# Altium schematic sheet gps_blk.SchDoc
size A4; Engineer: JBayalas; DocumentNumber: 6; Revision: V1.0; SheetNumber: 6; SheetTotal: 11
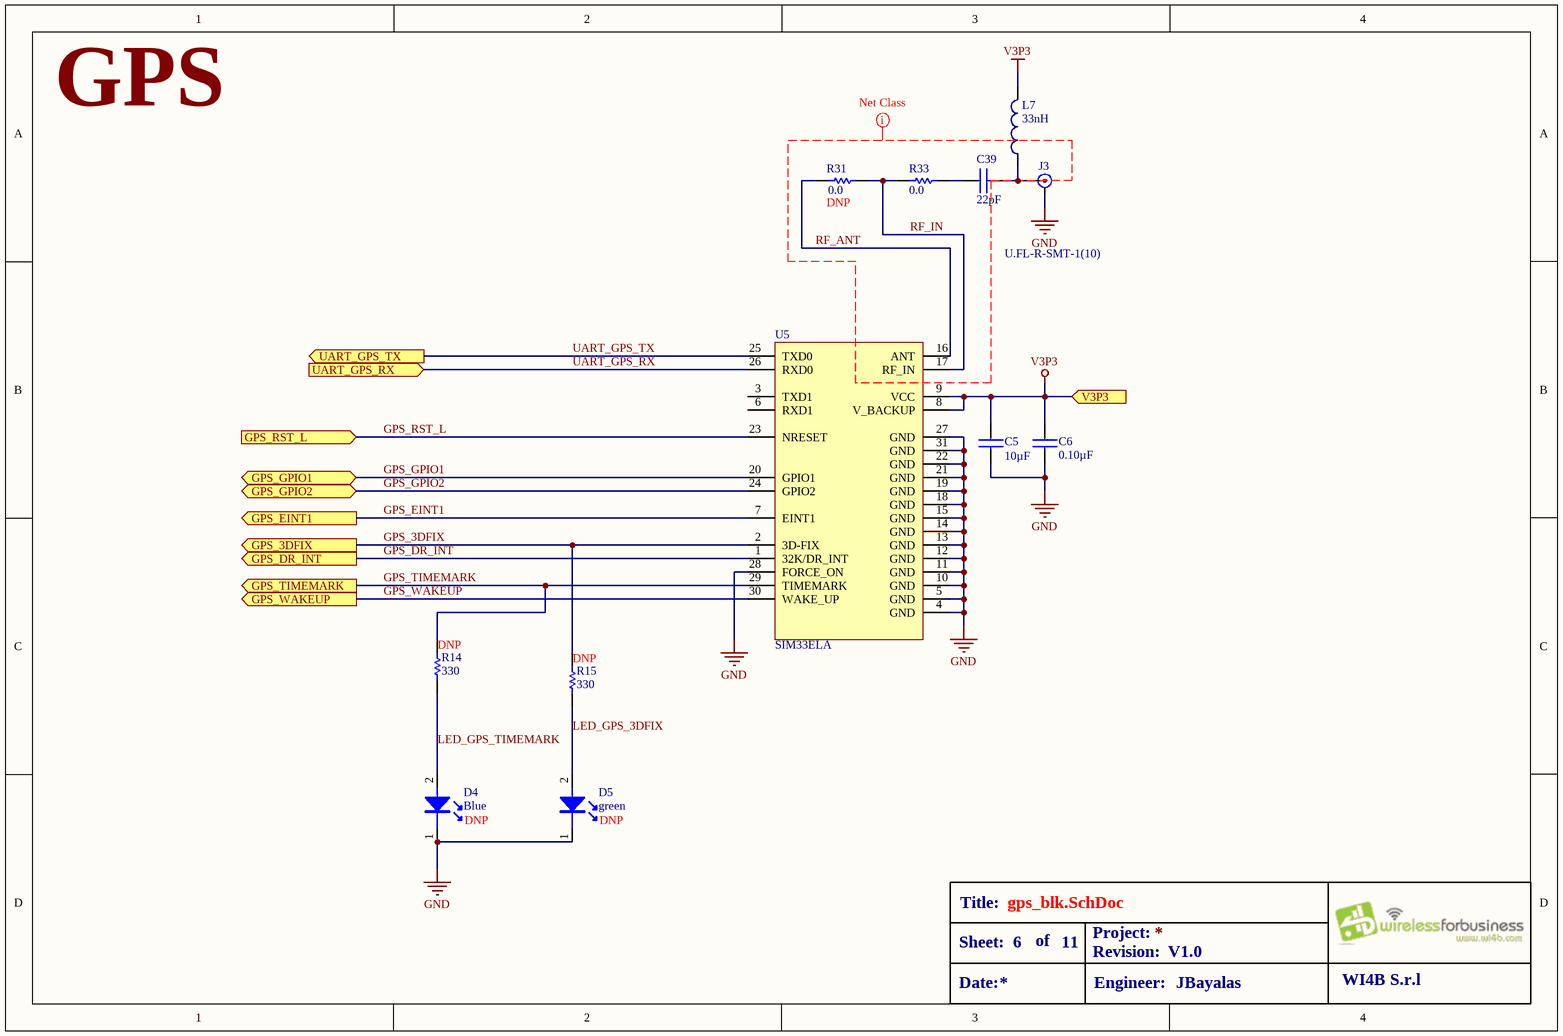
[diagram p0: gps_blk.SchDoc]

## Parts
C5  value 10µF  [C1206]  (hidden comment: GRM31CR71C106KAC7L)
C6  value 0.10µF  [C0402]  (hidden comment: GRM155R71H104ME14D)
C39  value 22pF  [C0402]  (hidden comment: GRM1555C1H220JA01J)
D4  value Blue  LOAD: DNP  [LED0402(BLUE)]  (hidden comment: *)
D5  value green  LOAD: DNP  [LED0402(GREEN)]  (hidden comment: *)
J3  U.FL-R-SMT-1(10)  [U.FL-R-SMT-1(10)]
L7  value 33nH  [0603 INDUCTOR]  (hidden comment: LQP18MN33NG02D)
R14  value 330  [R0402]  (hidden comment: CRCW0402330RFKED)
R15  value 330  [R0402]  (hidden comment: CRCW0402330RFKED)
R31  value 0.0  LOAD: DNP  [R0402]  (hidden comment: MCS04020Z0000ZE000)
R33  value 0.0  [R0402]  (hidden comment: MCS04020Z0000ZE000)
U5  SIM33ELA  [SIM33ELA]

## Ports
GPS_3DFIX (out), GPS_DR_INT (out), GPS_EINT1 (out), GPS_GPIO1 (bidir), GPS_GPIO2 (bidir), GPS_RST_L (in), GPS_TIMEMARK (out), GPS_WAKEUP (out), UART_GPS_RX (in), UART_GPS_TX (out), V3P3 (in)

## Nets
GND: C5.2 C6.2 D4.1 D5.1 J3.2(GND) U5.4(GND) U5.5(GND) U5.10(GND) U5.11(GND) U5.12(GND) U5.13(GND) U5.14(GND) U5.15(GND) U5.18(GND) U5.19(GND) U5.21(GND) U5.22(GND) U5.27(GND) U5.28(FORCE_ON) U5.31(GND)
V3P3: C5.1 C6.1 L7.1 U5.8(V_BACKUP) U5.9(VCC) ; port V3P3
GPS_3DFIX: R15.2 U5.2(3D-FIX) ; port GPS_3DFIX
GPS_DR_INT: U5.1(32K/DR_INT) ; port GPS_DR_INT
GPS_EINT1: U5.7(EINT1) ; port GPS_EINT1
GPS_GPIO1: U5.20(GPIO1) ; port GPS_GPIO1
GPS_GPIO2: U5.24(GPIO2) ; port GPS_GPIO2
GPS_RST_L: U5.23(NRESET) ; port GPS_RST_L
GPS_TIMEMARK: R14.2 U5.29(TIMEMARK) ; port GPS_TIMEMARK
GPS_WAKEUP: U5.30(WAKE_UP) ; port GPS_WAKEUP
LED_GPS_3DFIX: D5.2 R15.1
LED_GPS_TIMEMARK: D4.2 R14.1
RF_ANT: R31.1 U5.16(ANT)
RF_IN: R31.2 R33.1 U5.17(RF_IN)
UART_GPS_RX: U5.26(RXD0) ; port UART_GPS_RX
UART_GPS_TX: U5.25(TXD0) ; port UART_GPS_TX
NetC39_1: C39.1 R33.2
NetC39_2: C39.2 J3.1(SIGNAL) L7.2

Not connected (* = marked no-connect by the designer): U5 3(TXD1) 6(RXD1)

## Layout directives
net class 50 OHMS: RF_ANT, RF_IN

## Notes on the sheet
- GPS
- Title:
- Sheet:
- Date:
- of
- Project:
- Revision:
- Engineer:
- WI4B S.r.l

## Library data of the parts
C5 = GRM31CR71C106KAC7L: CAP CER 10UF 16V X7R 1206; MFT: Murata Electronics North America; TYPE: SMD; MPN: GRM31CR71C106KAC7L; RATING: 16V; DNP: *
C6 = GRM155R71H104ME14D: CAP CER 0.1UF 50V X7R 0402; MFT: Murata Electronics North America; TYPE: SMD; MPN: GRM155R71H104ME14D; RATING: 50V; DNP: *
C39 = GRM1555C1H220JA01J: CAP CER 22PF 50V NP0 0402; MFT: Murata Electronics North America; TYPE: SMD; FUNCTION: GPS; MPN: GRM1555C1H220JA01J; RATING: 50V
D4 = VLMB1500-GS08: LED BLUE 0402 SMD; MFT: Vishay Semiconductor Opto Division; MPN: VLMB1500-GS08; TYPE: SMD; RATING: *
D5 = XZVG68W-2: LED GREEN CLEAR CHIP SMD; MFT: SunLED; MPN: XZVG68W-2; TYPE: SMD; RATING: *
J3 = U.FL-R-SMT-1(10): CONN UMC JACK STR 50 OHM SMD; MFT: Hirose Electric Co Ltd; FUNCTION: GPS; MPN: U.FL-R-SMT-1(10)
L7 = LQP18MN33NG02D: FIXED IND 33NH 100MA 2.8 OHM SMD; MFT: Murata Electronics North America; FUNCTION: GPS; MPN: LQP18MN33NG02D; TYPE: SMD; RATING: 100MA 2.8 OHM
R14 R15 = CRCW0402330RFKED: RES SMD 330 OHM 1% 1/16W 0402; MFT: Vishay Dale; MPN: CRCW0402330RFKED; TYPE: SMD; RATING: 1/16W; DNP: DNP
R31 R33 = MCS04020Z0000ZE000: RES SMD 0.0OHM JUMPER 1/10W 0402; MFT: Vishay Beyschlag; RATING: 0.1W; MPN: MCS04020Z0000ZE000; TYPE: Surface Mount
U5 = SIM33ELA: A-GPS receiver, with built-in Antenna; MFT: SIMCom; VALUE: SIM33ELA; MPN: SIM33ELA